# EasyEDA schematic SCH_Brake chopper circuit BissC.json
TITLE: openFFB_prj; REV: 1.0; Date: 2022-01-14; Sheet: 1/1; Drawn By: Alexdelli
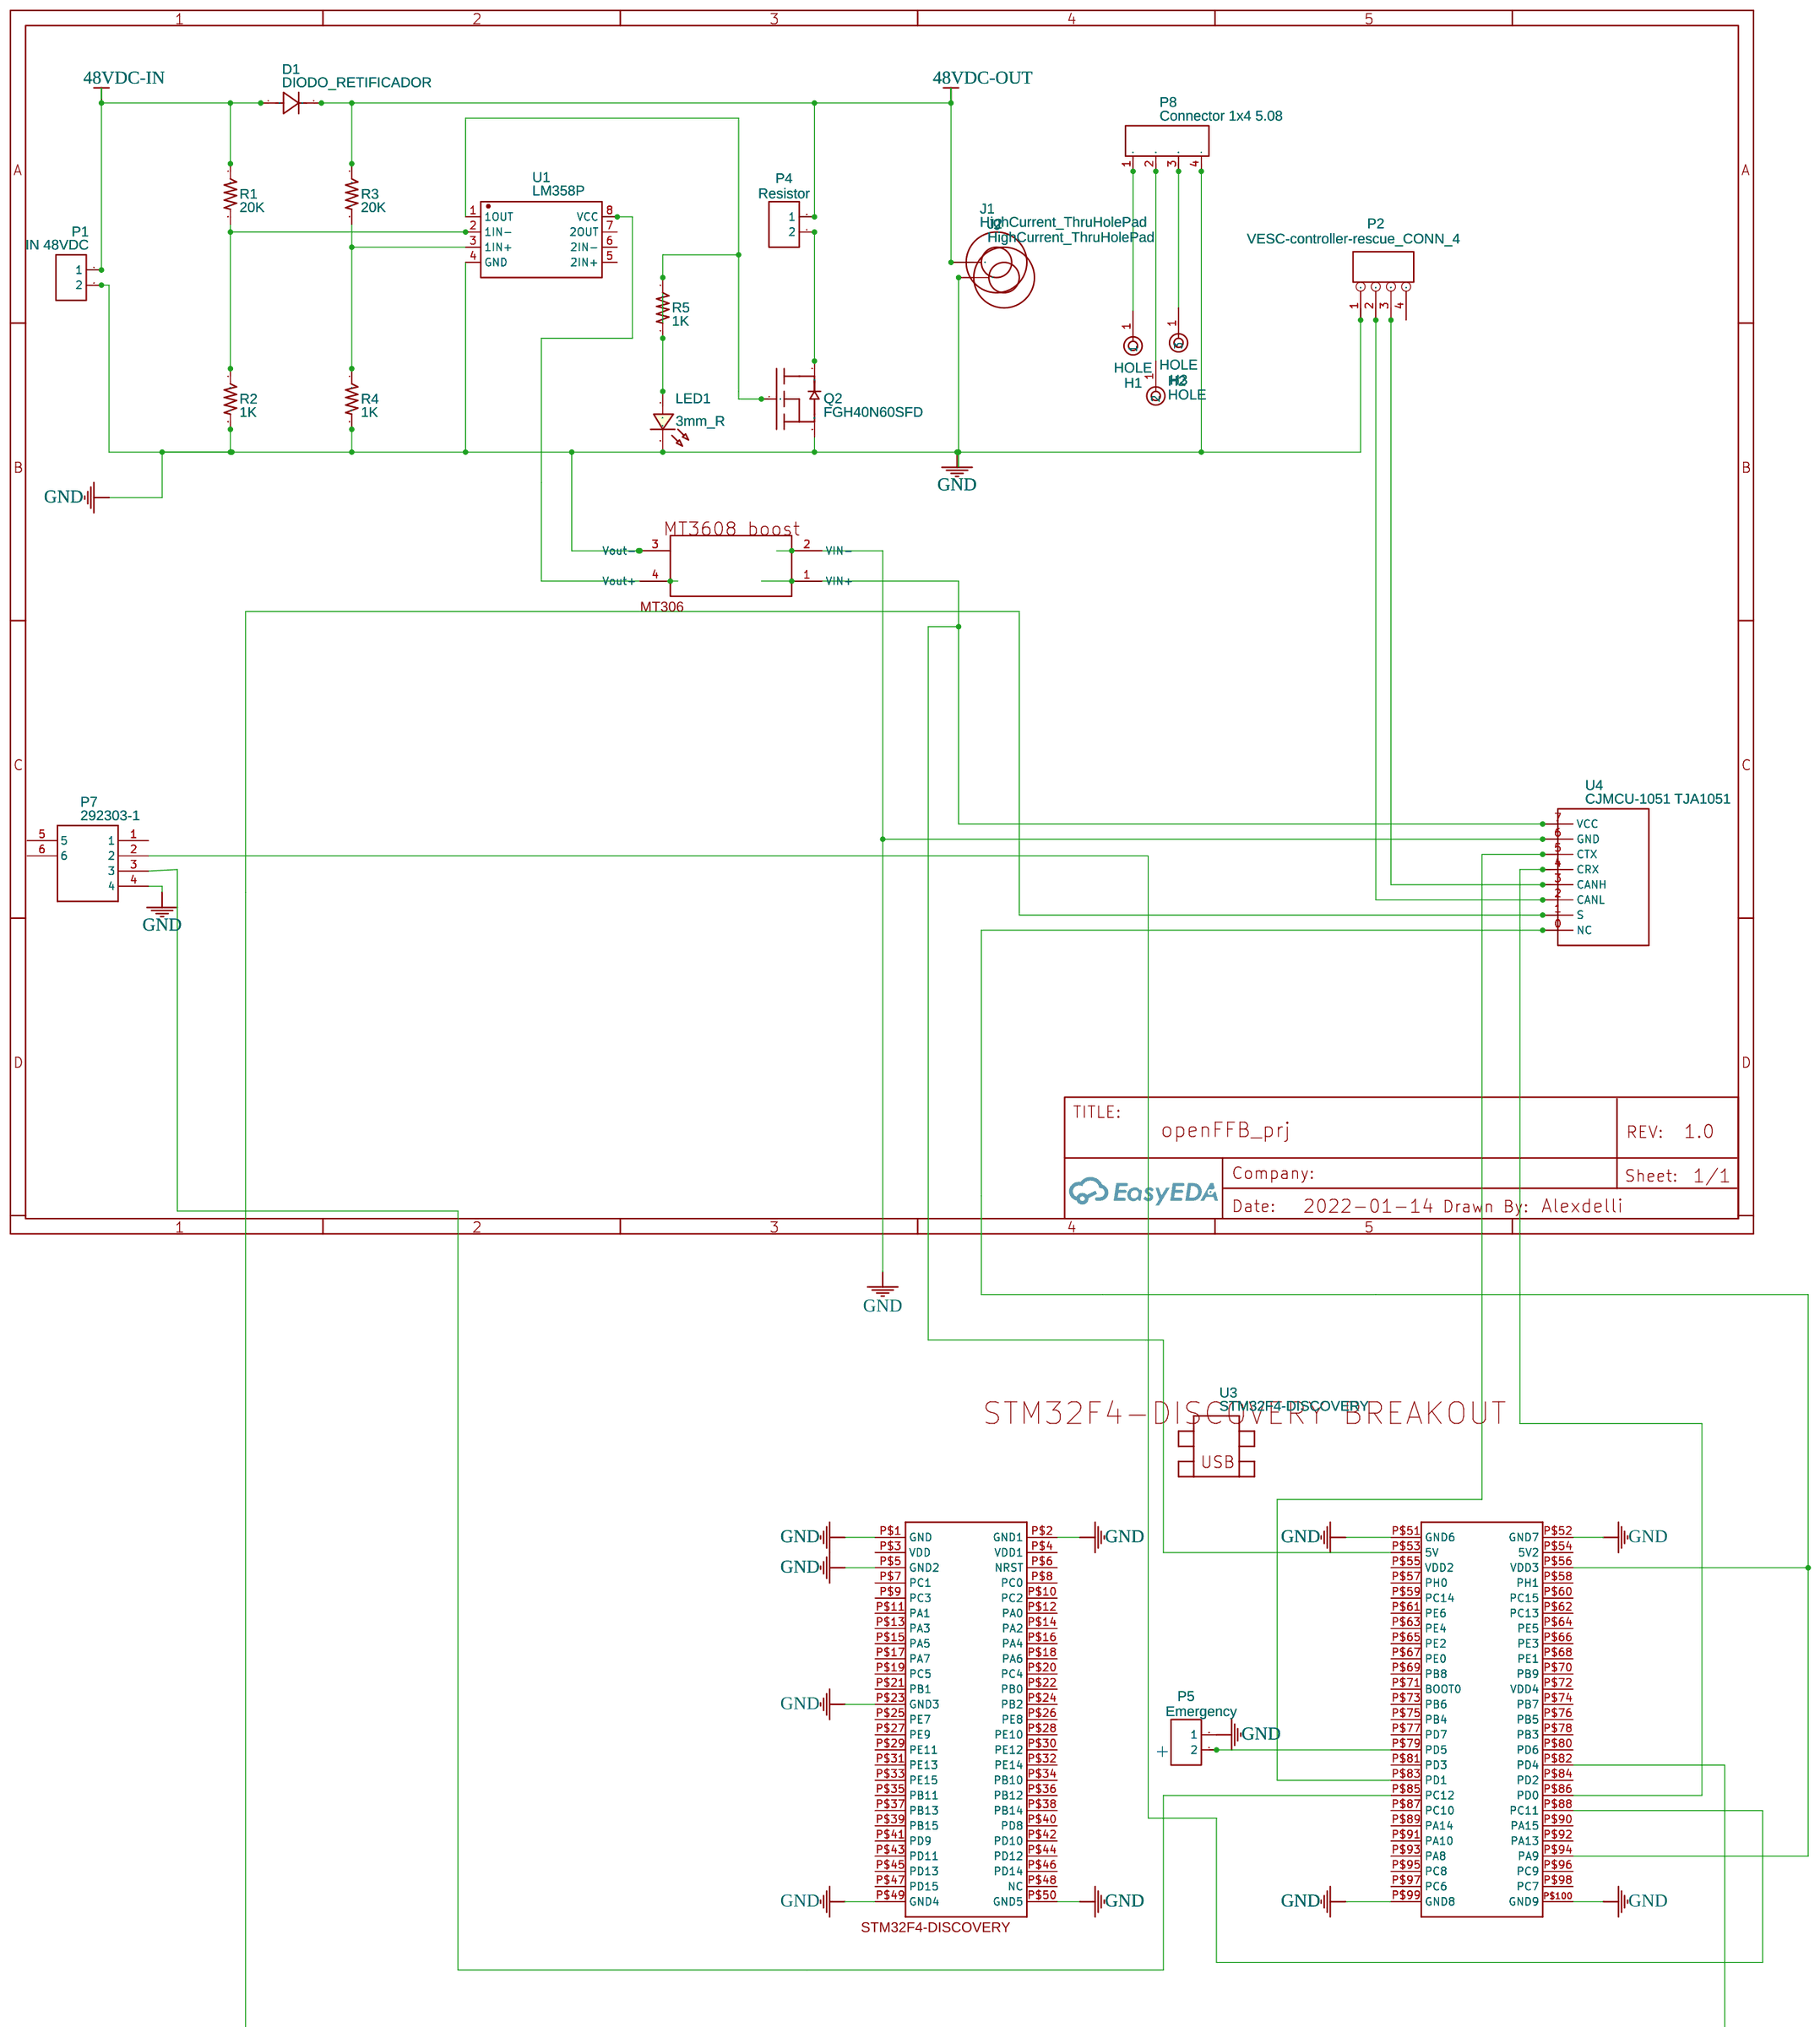
[diagram p0: schematic sheet]

## Parts
D1  DIODO_RETIFICADOR  [DIODO_DO41]
H1  HOLE  [HOLEHOLE]
H2  HOLE  [HOLEHOLE]
H3  HOLE  [HOLEHOLE]
J1  HighCurrent_ThruHolePad  [HIGH_CURRENT_THRUHOLEPAD]
J2  HighCurrent_ThruHolePad  [HIGH_CURRENT_THRUHOLEPAD]
LED1  3mm_R  [LED-TH_BD3.0_BLUE]
P1  IN 48VDC  [CONN-TH_2P-P5.08]
P2  VESC-controller-rescue_CONN_4  [CONN-TH_4P-P2.54-XH2.54-LI-4P]
P4  Resistor  [CONN-TH_2P-P5.08]
P5  Emergency  [CONN-TH_2P-P5.08]
P7  292303-1  [TECONN-4POS-USB]
P8  Connector 1x4 5.08  [CONNECTOR 1X4 MALE PITCH 5.08 PCB MALE]
Q2  FGH40N60SFD  [TO-3PN_L15.8-W5.0-P5.45-L]
R1  20K  [1/8W RESISTOR_1]
R2  1K  [1/8W RESISTOR_1]
R3  20K  [1/8W RESISTOR_1]
R4  1K  [1/8W RESISTOR_1]
R5  1K  [1/8W RESISTOR_1]
U1  LM358P  [DIP-8_L9.4-W6.4-P2.54-LS9.1-BL]
U2  mt306 boost  [MT306]
U3  STM32F4-DISCOVERY  [STM32F4-DISCOVERY]
U4  CJMCU-1051 TJA1051  [TJA1051 MODULE]

## Library data of the parts
D1 = DIODO_RETIFICADOR: Contributor: marciofaccin
H1-H3 = HOLE: Contributor: Fishy
J1 J2 = HighCurrent_ThruHolePad: Manufacturer: N/A; Manufacturer Part: N/A; Supplier Part: N/A; Contributor: EvanCYVision
LED1 = LED-TH-3mm_R: Manufacturer: EVERLIGHT(台湾亿光); Manufacturer Part: 204-10SDRD/S530-A3-L; Supplier Part: C84774; Supplier: LCSC; Contributor: LCEDA_Lib
P1 P4 P5 = CONN-TH_2P-P5.08: Supplier: LCSC; Contributor: LCEDA_Lib
P2 = VESC-controller-rescue_CONN_4: Contributor: Marat Ismagilov
P7 = 292303-1: Contributor: Ke'Ondrae_Mell
P8 = Connector 1x4 5.08: Contributor: Julio Gorsd
Q2 = FGH40N60SFD: Supplier: LCSC; Supplier Part: C898160; Manufacturer: ON(安森美); Contributor: leanhaudio
R1-R5 = Resistor: Contributor: SparkFun
U1 = LM358P: Supplier: LCSC; Manufacturer: TI; Supplier Part: C5213; JLCPCB Part Class: Extended Part
U2 = mt306 boost: Contributor: Hren_s_sharagi; Package Display: Yes
U3 = STM32F4-DISCOVERY: Package Display: Yes
U4 = CJMCU-1051 TJA1051: Manufacturer: CJMCU; Manufacturer Part: TJA1051; Supplier: CJMCU; Contributor: ArtemijDrDee

## Nets
48VDC-IN: D1.A P1.1 R1.1
48VDC-OUT: D1.K J1.1 P4.2(1) R3.1
GND: J2.1 LED1.2 P1.2 P2.1(P1) P5.2(1) P7.4 P8.4 Q2.3(S) R2.2 R4.2 U1.4(GND) U2.2(VIN-) U2.3(Vout-) U3.P$1(GND) U3.P$2(GND1) U3.P$5(GND2) U3.P$23(GND3) U3.P$49(GND4) U3.P$50(GND5) U3.P$51(GND6) U3.P$52(GND7) U3.P$99(GND8) U3.P$100(GND9) U4.6(GND)
Net-(H1-1): H1.1 P8.1
Net-(H2-1): H2.1(2) P8.2
Net-(H3-1): H3.1(3) P8.3
Net-(LED1-1): LED1.1 R5.2
Net-(P2-2): P2.2(P2) U4.2(CANL)
Net-(P2-3): P2.3(P3) U4.3(CANH)
Net-(P4-1): P4.1(2) Q2.2(D)
Net-(P5-1): P5.1(2) U3.P$79(PD5)
Net-(P7-2): P7.2 U3.P$88(PC11)
Net-(P7-3): P7.3 U3.P$85(PC12)
Net-(Q2-1): Q2.1(G) R5.1 U1.1(1OUT)
Net-(R1-2): R1.2 R2.1 U1.2(1IN-)
Net-(R3-2): R3.2 R4.1 U1.3(1IN+)
Net-(U1-8): U1.8(VCC) U2.4(Vout+)
Net-(U2-1): U2.1(VIN+) U3.P$53(5V) U4.7(VCC)
Net-(U3-P$56): U3.P$56(VDD3) U3.P$94(PA9) U4.0(NC)
Net-(U3-P$82): U3.P$82(PD4) U4.1(S)
Net-(U3-P$83): U3.P$83(PD1) U4.5(CTX)
Net-(U3-P$86): U3.P$86(PD0) U4.4(CRX)

Not connected (* = marked no-connect by the designer): P2 4(P4); P7 1 5 6; U1 5(2IN+) 6(2IN-) 7(2OUT); U3 P$3(VDD) P$4(VDD1) P$6(NRST) P$7(PC1) P$8(PC0) P$9(PC3) P$10(PC2) P$11(PA1) P$12(PA0) P$13(PA3) P$14(PA2) P$15(PA5) P$16(PA4) P$17(PA7) P$18(PA6) P$19(PC5) P$20(PC4) P$21(PB1) P$22(PB0) P$24(PB2) P$25(PE7) P$26(PE8) P$27(PE9) P$28(PE10) P$29(PE11) P$30(PE12) P$31(PE13) P$32(PE14) P$33(PE15) P$34(PB10) P$35(PB11) P$36(PB12) P$37(PB13) P$38(PB14) P$39(PB15) P$40(PD8) P$41(PD9) P$42(PD10) P$43(PD11) P$44(PD12) P$45(PD13) P$46(PD14) P$47(PD15) P$48(NC) P$54(5V2) P$55(VDD2) P$57(PH0) P$58(PH1) P$59(PC14) P$60(PC15) P$61(PE6) P$62(PC13) P$63(PE4) P$64(PE5) P$65(PE2) P$66(PE3) P$67(PE0) P$68(PE1) P$69(PB8) P$70(PB9) P$71(BOOT0) P$72(VDD4) P$73(PB6) P$74(PB7) P$75(PB4) P$76(PB5) P$77(PD7) P$78(PB3) P$80(PD6) P$81(PD3) P$84(PD2) P$87(PC10) P$89(PA14) P$90(PA15) P$91(PA10) P$92(PA13) P$93(PA8) P$95(PC8) P$96(PC9) P$97(PC6) P$98(PC7)

## Notes on the sheet
- +
